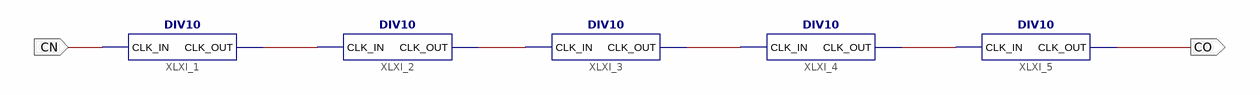
[diagram p0: schematic sheet 1]
// Xilinx ISE schematic DIV100K.sch (spartan6) as structural Verilog: 5 symbols, 2 ports
module DIV100K (
  input  CN,
  output CO
);

  wire XLXN_1, XLXN_2, XLXN_3, XLXN_4;

  DIV10 XLXI_1 (.CLK_IN(CN), .CLK_OUT(XLXN_1));
  DIV10 XLXI_2 (.CLK_IN(XLXN_1), .CLK_OUT(XLXN_2));
  DIV10 XLXI_3 (.CLK_IN(XLXN_2), .CLK_OUT(XLXN_3));
  DIV10 XLXI_4 (.CLK_IN(XLXN_3), .CLK_OUT(XLXN_4));
  DIV10 XLXI_5 (.CLK_IN(XLXN_4), .CLK_OUT(CO));
endmodule
